# EAGLE design Active_comm_connector_1_0 (EAGLE 6.6.0)
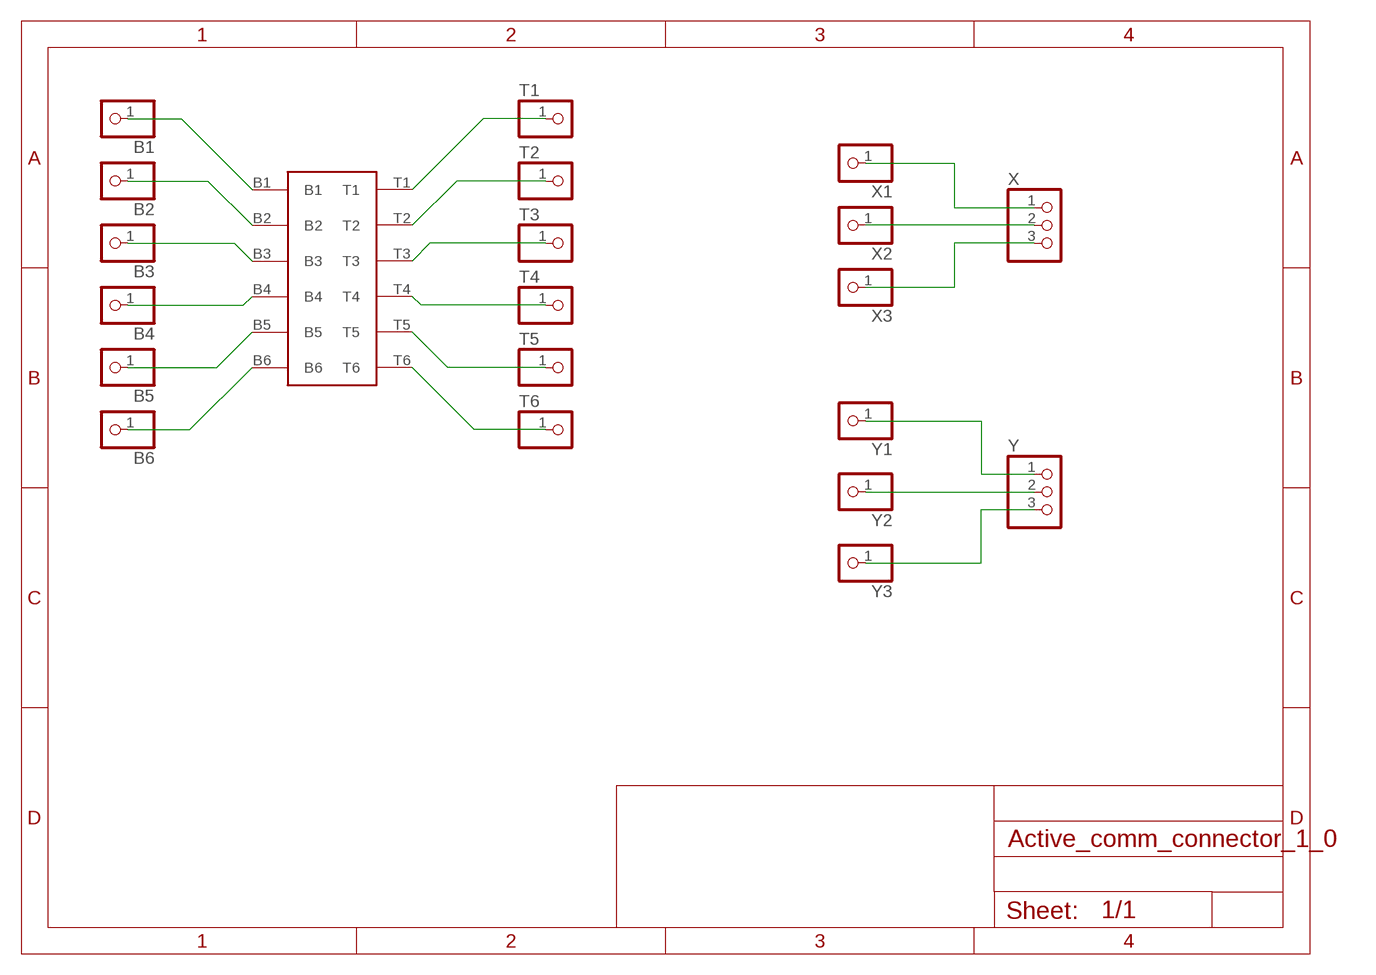
[diagram p0: schematic, sheet 1]

## Parts
B1  PINHD-1X1  [1X01]
B2  PINHD-1X1  [1X01]
B3  PINHD-1X1  [1X01]
B4  PINHD-1X1  [1X01]
B5  PINHD-1X1  [1X01]
B6  PINHD-1X1  [1X01]
PZN-12-VV  PZN-12-VV  [OMNETICS_PZN-12-VV]
T1  PINHD-1X1  [1X01]
T2  PINHD-1X1  [1X01]
T3  PINHD-1X1  [1X01]
T4  PINHD-1X1  [1X01]
T5  PINHD-1X1  [1X01]
T6  PINHD-1X1  [1X01]
X  PINHD-1X3  [1X03]
X1  PINHD-1X1  [1X01]
X2  PINHD-1X1  [1X01]
X3  PINHD-1X1  [1X01]
Y  PINHD-1X3  [1X03]
Y1  PINHD-1X1  [1X01]
Y2  PINHD-1X1  [1X01]
Y3  PINHD-1X1  [1X01]

## Nets
B4: B4.1 PZN-12-VV.B4
N$1: B1.1 PZN-12-VV.B1
N$2: B2.1 PZN-12-VV.B2
N$3: B3.1 PZN-12-VV.B3
N$4: Y1.1 Y.1
N$5: B5.1 PZN-12-VV.B5
N$6: B6.1 PZN-12-VV.B6
N$7: PZN-12-VV.T1 T1.1
N$8: PZN-12-VV.T2 T2.1
N$9: PZN-12-VV.T3 T3.1
N$10: PZN-12-VV.T4 T4.1
N$11: PZN-12-VV.T5 T5.1
N$12: PZN-12-VV.T6 T6.1
N$13: Y2.1 Y.2
N$14: Y3.1 Y.3
N$16: X2.1 X.2
N$17: X3.1 X.3
XX1: X1.1 X.1

## Library data of the parts
B1-B6 T1-T6 X1-X3 Y1-Y3 = adafruit:PINHD-1X1: Pin header 1x1 for 0.1" spacing With round pins
PZN-12-VV = omnetics_con:PZN-12-VV
X Y = adafruit:PINHD-1X3: PIN HEADER

## Board
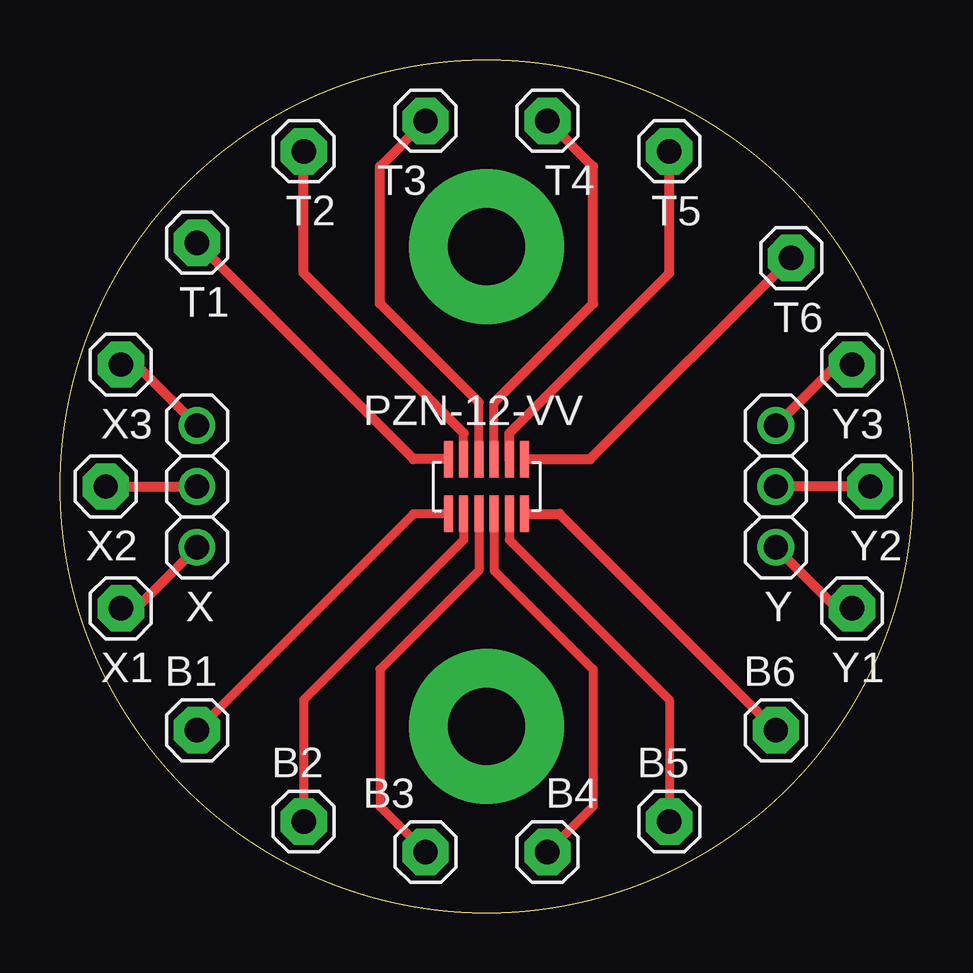
[diagram p1: board, top side]

Size 35.56 x 35.56 mm. Coordinates in mm from the lower left corner, seen from the top.
Outline: circle at 17.78,17.78 radius 17.78
Copper layers (1*16): Top 0.035mm / dielectric 1.5mm / Bottom 0.035mm
Design rules "default": minimum track width 10mil, minimum drill 24mil, track to track 8mil, track to pad 8mil, pad to pad 8mil, via to via 8mil, smd to smd 8mil, copper to edge 40mil, drill to drill 8mil, minimum pad ring 10mil, minimum via ring 8mil, stop-mask expansion 4mil, vias tented up to drill 0mil, thermal gap 10mil

### Footprints (pad centres in the part's own frame; a part is rotated, then mirrored left to right if it is on the bottom)
1X01 = drill 1.016 pad 1.93 octagon: 1 0,0
OMNETICS_PZN-12-VV = smd 0.381 x 1.524: B1 1.587,1.143; B2 0.953,1.143; B3 0.318,1.143; B4 -0.318,1.143; B5 -0.953,1.143; B6 -1.587,1.143; T1 1.587,-1.143; T2 0.953,-1.143; T3 0.318,-1.143; T4 -0.318,-1.143; T5 -0.953,-1.143; T6 -1.587,-1.143
1X03 = drill 1.016: 1 -2.54,0; 2 0,0; 3 2.54,0

### Placement (x,y rotation side)
B1  5.71,7.62 0 top
B2  10.16,3.81 0 top
B3  15.24,2.54 0 top
B4  20.32,2.54 0 top
B5  25.4,3.81 0 top
B6  29.84,7.62 0 top
PZN-12-VV  17.78,17.78 180 top
T1  5.71,27.94 180 top
T2  10.16,31.75 180 top
T3  15.24,33.02 180 top
T4  20.32,33.02 180 top
T5  25.4,31.75 180 top
T6  30.48,27.3 180 top
X  5.71,17.78 90 top
X1  2.54,12.7 180 top
X2  1.91,17.78 180 top
X3  2.54,22.86 180 top
Y  29.84,17.78 90 top
Y1  33.02,12.7 180 top
Y2  33.78,17.78 180 top
Y3  33.02,22.86 180 top

### Tracks (layer width: path | path; a pad name or v marks a point on that pad's centre or on a via)
B4
  Top 0.381: PZN-12-VV.B4 18.1,14.29 22.23,10.16 22.23,4.45 B4.1
N$1
  Top 0.381: PZN-12-VV.B1 14.73,16.64 B1.1
N$2
  Top 0.381: PZN-12-VV.B2 16.83,15.56 10.16,8.89 B2.1
N$3
  Top 0.381: PZN-12-VV.B3 17.46,14.29 13.34,10.16 13.34,4.45 B3.1
N$4
  Top 0.406: Y1.1 32.38,12.7 Y.1
N$5
  Top 0.381: PZN-12-VV.B5 18.73,15.56 25.4,8.89 B5.1
N$6
  Top 0.406: PZN-12-VV.B6 20.83,16.64 B6.1
N$7
  Top 0.406: PZN-12-VV.T1 14.73,18.92 T1.1
N$8
  Top 0.381: PZN-12-VV.T2 16.83,20
  Top 0.406: 16.83,20 10.16,26.67 T2.1
N$9
  Top 0.381: PZN-12-VV.T3 17.46,21.27
  Top 0.406: 17.46,21.27 13.34,25.4 13.34,31.11 T3.1
N$10
  Top 0.381: PZN-12-VV.T4 18.1,21.27
  Top 0.406: 18.1,21.27 22.23,25.4 22.23,31.11 T4.1
N$11
  Top 0.406: PZN-12-VV.T5 18.73,20 25.4,26.67 T5.1
N$12
  Top 0.406: PZN-12-VV.T6 22.1,18.92 T6.1
N$13
  Top 0.406: Y2.1 Y.2
N$14
  Top 0.406: Y3.1 32.38,22.86 Y.3
N$16
  Top 0.406: X2.1 X.2
N$17
  Top 0.406: X3.1 3.17,22.86 X.3
N$18  (via drill 3.2 pad 6.45)
  other vias: 17.78,7.78
N$19  (via drill 3.2 pad 6.45)
  other vias: 17.78,27.78
XX1
  Top 0.406: X1.1 3.17,12.7 X.1